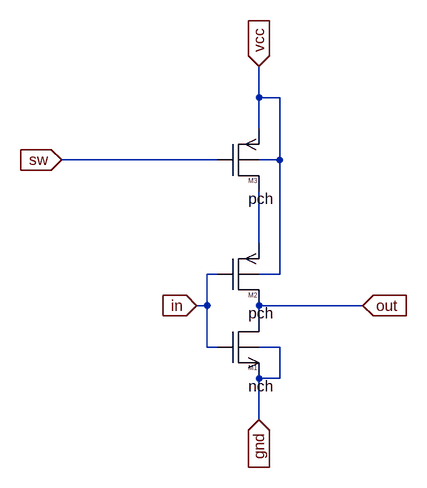
[diagram p0: schematic myinv_tg.asc]
myinv_tg.asc, the LTspice schematic file:
Version 4
SHEET 1 880 680
WIRE 176 -192 176 -240
WIRE 208 -192 176 -192
WIRE 176 -144 176 -192
WIRE 112 -96 -128 -96
WIRE 208 -96 208 -192
WIRE 208 -96 176 -96
WIRE 176 32 176 -48
WIRE 112 80 96 80
WIRE 208 80 208 -96
WIRE 208 80 176 80
WIRE 96 128 96 80
WIRE 96 128 80 128
WIRE 336 128 176 128
WIRE 176 144 176 128
WIRE 96 192 96 128
WIRE 112 192 96 192
WIRE 208 192 176 192
WIRE 208 240 208 192
WIRE 208 240 176 240
WIRE 176 304 176 240
FLAG 176 304 gnd
IOPIN 176 304 In
FLAG 176 -240 vcc
IOPIN 176 -240 In
FLAG 80 128 in
IOPIN 80 128 In
FLAG 336 128 out
IOPIN 336 128 In
FLAG -128 -96 sw
IOPIN -128 -96 In
SYMBOL nmos4 112 192 R0
WINDOW 3 48 60 Left 2
SYMATTR InstName M1
SYMATTR Value nch
SYMATTR Value2 l=2u w=6u
SYMBOL pmos4 112 80 R0
WINDOW 3 48 60 Left 2
SYMATTR InstName M2
SYMATTR Value pch
SYMATTR Value2 l=2u w=18u
SYMBOL pmos4 112 -96 R0
WINDOW 3 48 60 Left 2
SYMATTR InstName M3
SYMATTR Value pch
SYMATTR Value2 l=2u w=150u

The netlist it stands for:
* myinv_tg.asc
M1 out in gnd gnd nch l=2u w=6u
M2 out in N001 vcc pch l=2u w=18u
M3 N001 sw vcc vcc pch l=2u w=150u
.model NMOS NMOS
.model PMOS PMOS
.lib standard.mos
.backanno
.end